# Altium schematic sheet LCs.SchDoc
size Letter; DrawnBy: Adam Gilbert; Organization: Altium Limited; Address1: L3, 12a Rodborough Rd; Address2: Frenchs Forest; Address3: NSW; Address4: Australia 2086; DocumentNumber: 4; SheetNumber: 4; SheetTotal: 4
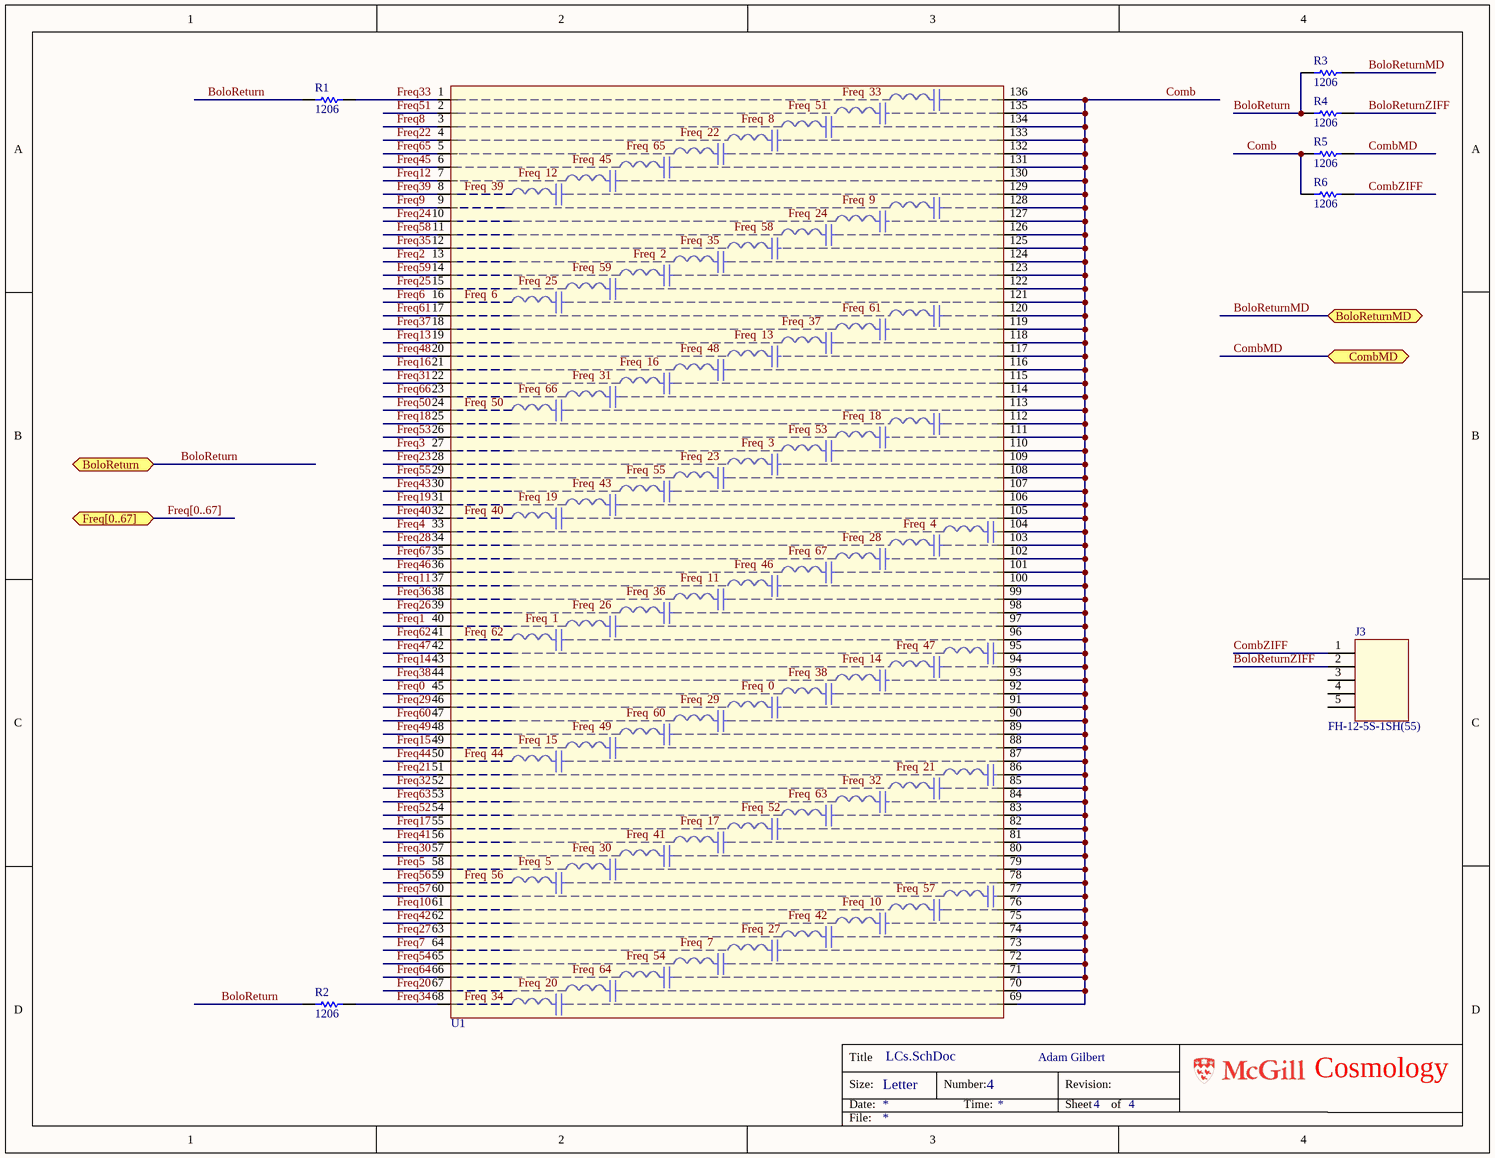
[diagram p0: LCs.SchDoc]

## Parts
J3  FH-12-5S-1SH(55)  [FH-12-5S-1SH(55)]
R1  Res1206  [1206]  (value not drawn)
R2  Res1206  [1206]  (value not drawn)
R3  Res1206  [1206]  (value not drawn)
R4  Res1206  [1206]  (value not drawn)
R5  Res1206  [1206]  (value not drawn)
R6  Res1206  [1206]  (value not drawn)
U1  LC68_wafer  [68xLC]  (value not drawn)

## Ports
BoloReturn, BoloReturnMD, CombMD, Freq[0..67]

## Nets
BoloReturn: R1.1 R2.1 R3.1 R4.1 ; port BoloReturn
BoloReturnMD: R3.2 ; port BoloReturnMD
BoloReturnZIFF: J3.2 R4.2
Comb: R5.1 R6.1 U1.69 U1.70 U1.71 U1.72 U1.73 U1.74 U1.75 U1.76 U1.77 U1.78 U1.79 U1.80 U1.81 U1.82 U1.83 U1.84 U1.85 U1.86 U1.87 U1.88 U1.89 U1.90 U1.91 U1.92 U1.93 U1.94 U1.95 U1.96 U1.97 U1.98 U1.99 U1.100 U1.101 U1.102 U1.103 U1.104 U1.105 U1.106 U1.107 U1.108 U1.109 U1.110 U1.111 U1.112 U1.113 U1.114 U1.115 U1.116 U1.117 U1.118 U1.119 U1.120 U1.121 U1.122 U1.123 U1.124 U1.125 U1.126 U1.127 U1.128 U1.129 U1.130 U1.131 U1.132 U1.133 U1.134 U1.135 U1.136
CombMD: R5.2 ; port CombMD
CombZIFF: J3.1 R6.2
Freq0: U1.45
Freq1: U1.40
Freq2: U1.13
Freq3: U1.27
Freq4: U1.33
Freq5: U1.58
Freq6: U1.16
Freq7: U1.64
Freq8: U1.3
Freq9: U1.9
Freq10: U1.61
Freq11: U1.37
Freq12: U1.7
Freq13: U1.19
Freq14: U1.43
Freq15: U1.49
Freq16: U1.21
Freq17: U1.55
Freq18: U1.25
Freq19: U1.31
Freq20: U1.67
Freq21: U1.51
Freq22: U1.4
Freq23: U1.28
Freq24: U1.10
Freq25: U1.15
Freq26: U1.39
Freq27: U1.63
Freq28: U1.34
Freq29: U1.46
Freq30: U1.57
Freq31: U1.22
Freq32: U1.52
Freq33: R1.2 U1.1
Freq34: R2.2 U1.68
Freq35: U1.12
Freq36: U1.38
Freq37: U1.18
Freq38: U1.44
Freq39: U1.8
Freq40: U1.32
Freq41: U1.56
Freq42: U1.62
Freq43: U1.30
Freq44: U1.50
Freq45: U1.6
Freq46: U1.36
Freq47: U1.42
Freq48: U1.20
Freq49: U1.48
Freq50: U1.24
Freq51: U1.2
Freq52: U1.54
Freq53: U1.26
Freq54: U1.65
Freq55: U1.29
Freq56: U1.59
Freq57: U1.60
Freq58: U1.11
Freq59: U1.14
Freq60: U1.47
Freq61: U1.17
Freq62: U1.41
Freq63: U1.53
Freq64: U1.66
Freq65: U1.5
Freq66: U1.23
Freq67: U1.35

Not connected (* = marked no-connect by the designer): J3 3 4 5

## Buses and harness runs
bus Freq[0..67] = port Freq[0..67]

## Notes on the sheet
- Title
- Size:
- Date:
- Letter
- Number:
- Time:
- Revision:
- Sheet
- of
- Cosmology
- File:
- (in symbol LC68Wafer) Freq; 0

## Library data of the parts
R1-R6 = Res1206: Resistor; Param1: 100ppm/C; Value: DNL; Param: 1%; TechInfo: *
U1 = LC68Wafer: Gold bonded integrated LC